# EAGLE design BatteryChecker (EAGLE 7.1.0)
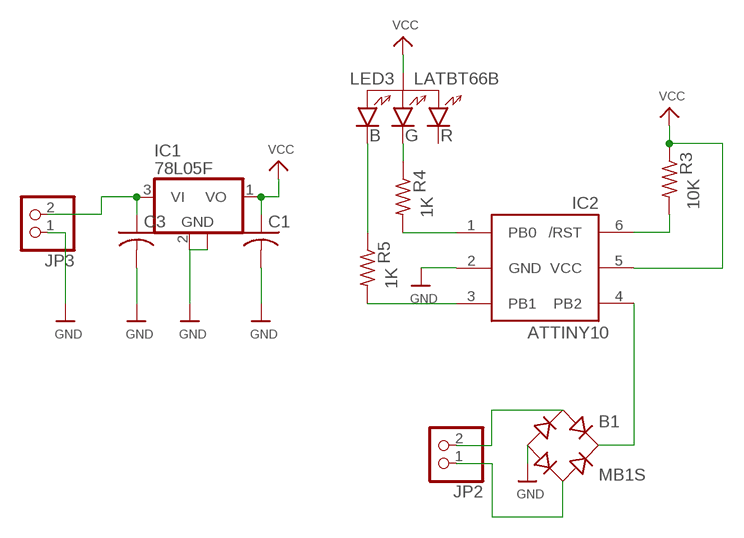
[diagram p0: schematic, sheet 1]

## Parts
B1  MB1S  [SOIC-4]
C1  C-USC0603  [C0603]
C3  C-USC0603  [C0603]
IC1  78L05F  [SOT89]
IC2  ATTINY10  [SOT23-6]
JP2  HEADER-1X2  [1X02_OVAL]
JP3  HEADER-1X2  [1X02_OVAL]
LED3  LATBT66B  [P-LCC-4]
R3  R-US_R0603  [R0603]
R4  R-US_R0603  [R0603]
R5  R-US_R0603  [R0603]

## Nets
GND: B1.- C1.2 C3.2 IC1.2(GND) IC1.2@1(GND) IC2.2(GND) JP3.1
N$1: B1.+ IC2.4(PB2)
N$2: LED3.P$4 R4.1
N$3: IC2.1(PB0) R4.2
N$4: C3.1 IC1.3(VI) JP3.2
N$5: IC2.6(/RST) R3.2
N$6: IC2.3(PB1) R5.2
N$7: LED3.P$3 R5.1
N$10: B1.~1(AC1) JP2.2
N$11: B1.~2(AC2) JP2.1
VCC: C1.1 IC1.1(VO) IC2.5(VCC) LED3.P$2 R3.1
Unconnected: LED3.P$1

## Library data of the parts
B1 = rectifier:MB*S: Bridge Rectifier Source: http://www.fairchildsemi.com/ds/MB/MB6S.pdf
C1 C3 = adafruit:C-US: CAPACITOR, American symbol
IC1 = linear:78L*: POSITOIV-VOLTAGE REGULATORS Output up to 100 mA Source: Datasheet <http://focus.ti.com/lit/ds/symlink/ua78l05.pdf>
IC2 = adafruit:ATTINY10: ATtiny4/5/9/10 8-bit Microcontroller with 512/1024 Bytes In-System Programmable Flash
JP2 JP3 = OLED_mod:HEADER-1X2: PIN HEADER
LED3 = TOG:LATBT66B: RGB LED SMD
R3 = adafruit:R-US_: RESISTOR, American symbol; VAL: 10K
R4 R5 = adafruit:R-US_: RESISTOR, American symbol; VAL: 1K

## Board
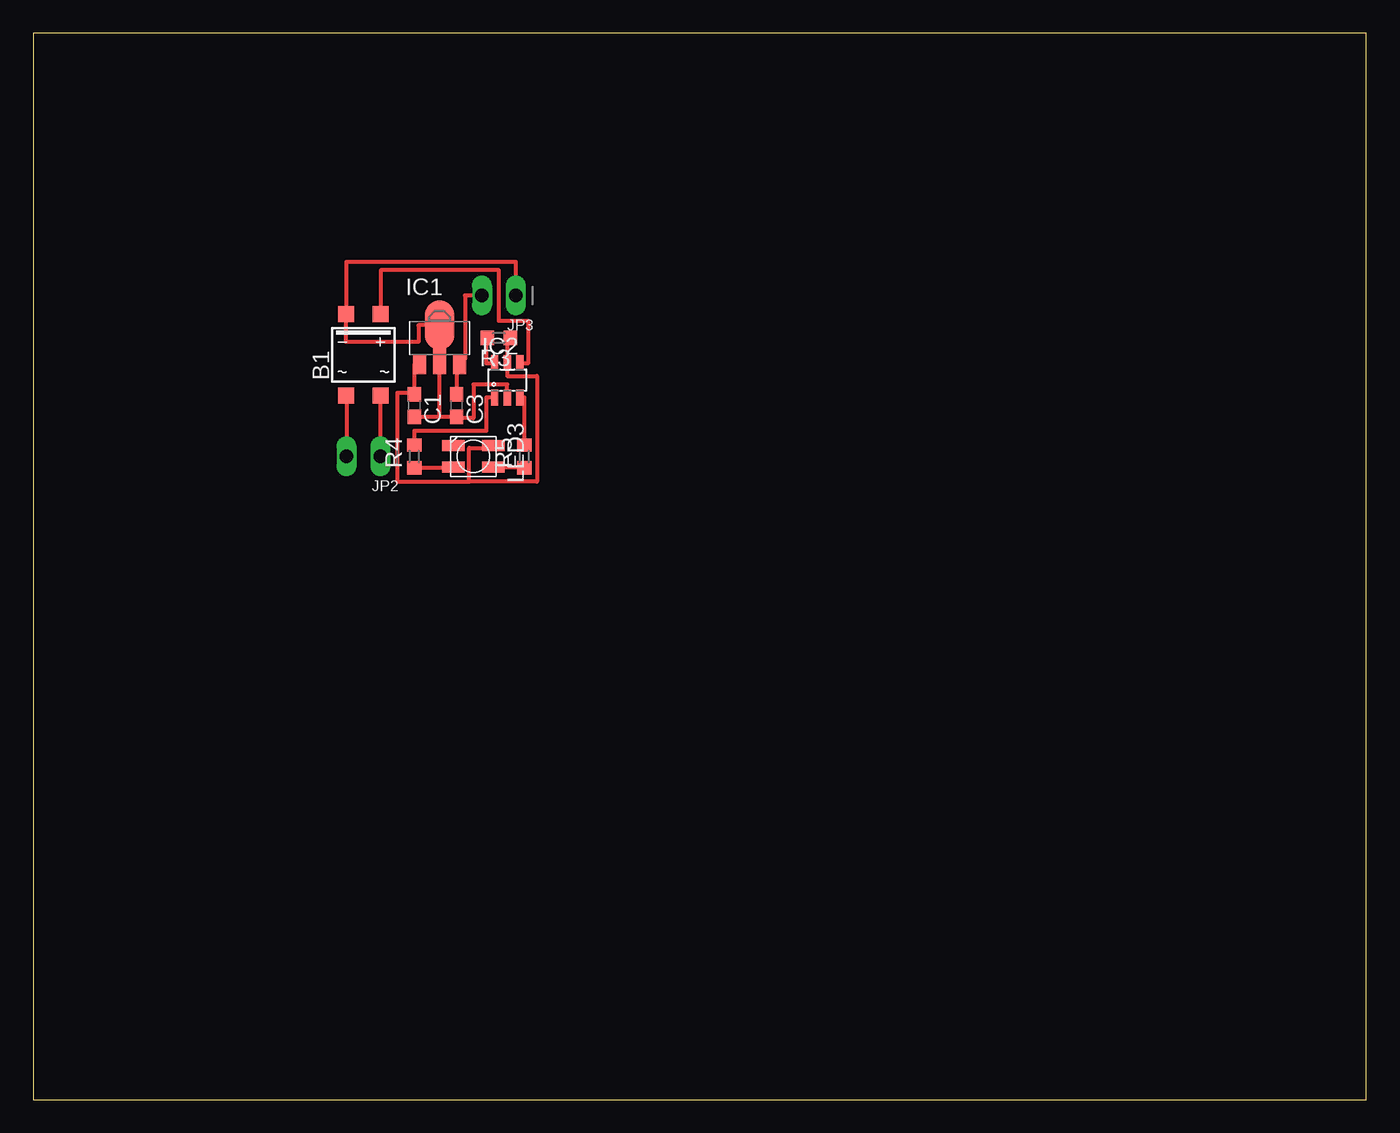
[diagram p1: board, top side]

Size 100 x 80 mm. Coordinates in mm from the lower left corner, seen from the top.
Outline: 0,0 100,0 100,80 0,80 0,0
Copper layers (1*16): Top 0.035mm / dielectric 1.5mm / Bottom 0.035mm
Design rules "default": minimum track width 10mil, minimum drill 24mil, track to track 8mil, track to pad 8mil, pad to pad 8mil, via to via 8mil, smd to smd 8mil, copper to edge 40mil, drill to drill 8mil, minimum pad ring 10mil, minimum via ring 8mil, stop-mask expansion 4mil, vias tented up to drill 0mil, thermal gap 10mil

### Footprints (pad centres in the part's own frame; a part is rotated, then mirrored left to right if it is on the bottom)
SOIC-4 = smd 1.2 x 1.2: + 1.3,3.05; - -1.3,3.05; ~1 -1.3,-3.05; ~2 1.3,-3.05
C0603 = smd 1.1 x 1: 1 -0.85,0; 2 0.85,0
SOT89 = smd 1 x 1.5: 1 -1.499,-1.981; 3 1.499,-1.981 | smd 1 x 2: 2 0,-1.727 | smd 2.2 x 3.7: 2@1 0,0.94
SOT23-6 = smd 0.55 x 1.2: 1 -0.95,-1.3; 2 0,-1.3; 3 0.95,-1.3; 4 0.95,1.3; 5 0,1.3; 6 -0.95,1.3
1X02_OVAL = drill 1 long: 1 -1.27,0; 2 1.27,0
P-LCC-4 = smd 0.813 x 1.676: P$1 -0.8,-1.5; P$2 -0.8,1.5; P$3 0.8,1.5; P$4 0.8,-1.5
R0603 = smd 1 x 1.1: 1 -0.85,0; 2 0.85,0

### Placement (x,y rotation side)
B1  24.77,55.88 0 top
C1  28.57,52.07 270 top
C3  31.75,52.07 270 top
IC1  30.48,57.15 0 top
IC2  35.56,53.98 0 top
JP2  24.77,48.26 180 top
JP3  34.92,60.33 180 top
LED3  33.02,48.26 270 top
R3  34.92,57.15 180 top
R4  28.57,48.26 90 top
R5  36.83,48.26 90 top

### Tracks (layer width: path | path; a pad name or v marks a point on that pad's centre or on a via)
GND
  Top 0.305: C3.2 C1.2 | C3.2 30.48,51.22 IC1.2 IC1.2@1 28.89,58.09 28.89,56.83 23.46,56.83 B1.- 23.5,58.93 23.5,62.87 36.2,62.87 JP3.1 | IC2.2 35.56,53.66 33.02,53.66 33.02,51.12 31.75,51.12 C3.2
N$1
  Top 0.305: IC2.4 37.15,55.27 37.15,58.42 34.92,58.42 34.92,62.23 26.07,62.23 B1.+
N$2
  Top 0.305: R4.1 31.52,47.41 LED3.P$4
N$3
  Top 0.305: IC2.1 33.97,52.67 33.97,50.16 28.57,50.16 R4.2
N$4
  Top 0.305: C3.1 31.75,55.17 IC1.3 31.98,55.56 32.38,55.56 32.38,60.33 JP3.2
N$5
  Top 0.305: R3.2 33.97,57.15 33.97,55.24 34.61,55.24 IC2.6
N$6
  Top 0.305: IC2.3 36.83,52.67 R5.2
N$7
  Top 0.305: LED3.P$3 36.83,47.46 R5.1
N$10
  Top 0.305: B1.~1 23.5,52.83 JP2.2
N$11
  Top 0.305: B1.~2 26.04,52.83 JP2.1
VCC
  Top 0.305: 28.57,53.02 C1.1 | IC1.1 28.57,55.17 28.57,53.02 | 28.57,53.02 27.3,53.02 27.3,46.35 32.7,46.35 | 32.7,46.35 32.7,48.9 34.52,48.9 LED3.P$2 | R3.1 35.56,57.15 IC2.5 35.56,54.29 37.78,54.29 37.78,46.35 32.7,46.35